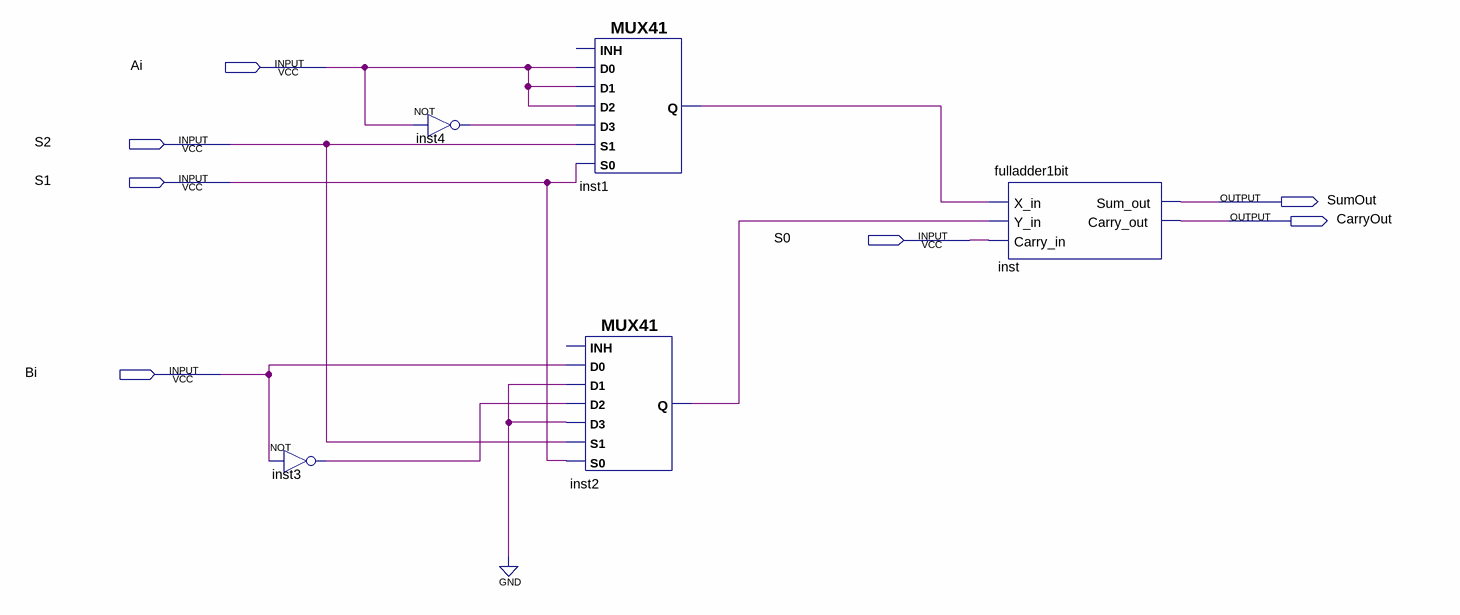
[diagram p0: schematic sheet]
// Quartus schematic arithcircuit1bit2.bdf as structural Verilog: 5 symbols, 7 pins
module arithcircuit1bit2 (
  input  Ai,
  input  S2,
  input  S1,
  input  S0,
  input  Bi,
  output SumOut,
  output CarryOut
);

  wire inst1_q, inst2_q, inst3_out, inst4_out;

  not inst3 (inst3_out, Bi);
  not inst4 (inst4_out, Ai);
  MUX41 inst2 (.S0(S1), .D2(inst3_out), .S1(S2), .D3(1'b0), .D0(Bi), .D1(1'b0), .Q(inst2_q));  // open: INH
  MUX41 inst1 (.S0(S1), .D2(Ai), .S1(S2), .D3(inst4_out), .D0(Ai), .D1(Ai), .Q(inst1_q));  // open: INH
  fulladder1bit inst (.X_in(inst1_q), .Y_in(inst2_q), .Carry_in(S0), .Sum_out(SumOut), .Carry_out(CarryOut));
endmodule
